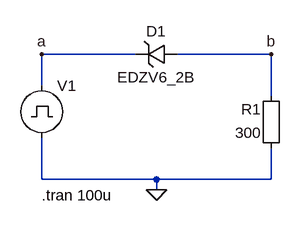
[diagram p0: schematic Z-CL-S.asc]
Z-CL-S.asc, the LTspice schematic file:
Version 4
SHEET 1 880 680
WIRE 16 112 -128 112
WIRE 224 112 80 112
WIRE -128 160 -128 112
WIRE 224 176 224 112
WIRE -128 304 -128 240
WIRE 48 304 -128 304
WIRE 224 304 224 256
WIRE 224 304 48 304
WIRE 48 320 48 304
FLAG -128 112 a
FLAG 224 112 b
FLAG 48 320 0
SYMBOL Misc\\EuropeanResistor 240 272 R180
WINDOW 0 31 76 Left 2
WINDOW 3 31 40 Left 2
SYMATTR InstName R1
SYMATTR Value 300
SYMBOL zener 80 96 R90
WINDOW 0 -4 32 VBottom 2
WINDOW 3 36 32 VTop 2
SYMATTR InstName D1
SYMATTR Value EDZV6_2B
SYMATTR Description Diode
SYMATTR Type diode
SYMBOL pulse -128 144 R0
WINDOW 3 24 44 Invisible 2
WINDOW 123 0 0 Left 2
WINDOW 39 0 0 Left 2
SYMATTR Value PULSE(0 8V 5u 1u 1u 20u 50u)
SYMATTR InstName V1
TEXT -128 328 Left 2 !.tran 100u

The netlist it stands for:
* Z-CL-S.asc
R1 0 b 300
D1 b a EDZV6_2B
V1 a 0 PULSE(0 8V 5u 1u 1u 20u 50u)
.model D D
.lib standard.dio
.tran 100u
.backanno
.end